# Altium schematic sheet ButtonStick.SchDoc: Button Stick
size Letter; ApprovedBy: Kevin Cotton; Author: Jessica Di Stefano; DrawnBy: J; Revision: A; SheetNumber: 3; SheetTotal: 7
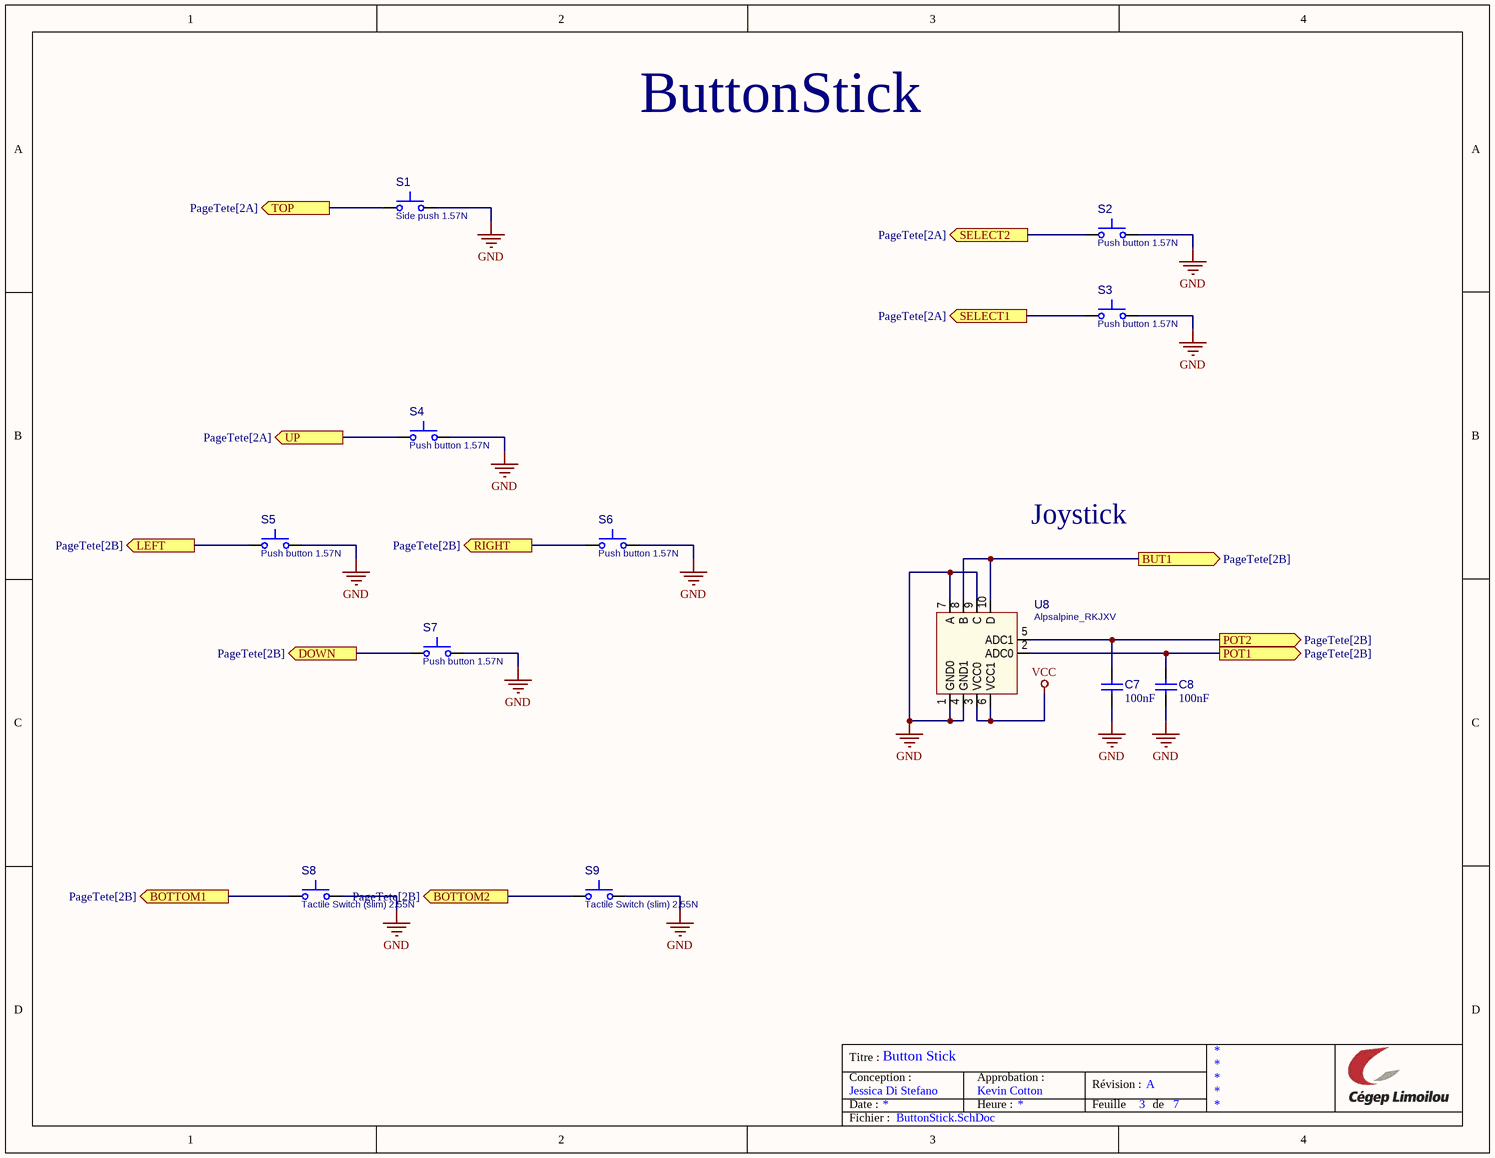
[diagram p0: ButtonStick.SchDoc]

## Parts
C7  value 100nF  [C_1005[0402]]  (hidden comment: Cap 100nF 0402)
C8  value 100nF  [C_1005[0402]]  (hidden comment: Cap 100nF 0402)
S1  value Side push 1.57N  [S_Alpsalpine_SKHHL]  (hidden comment: SKHHLNA010)
S2  value Push button 1.57N  [S_Alpsalpine_SKPM]  (hidden comment: SKPMAME010)
S3  value Push button 1.57N  [S_Alpsalpine_SKPM]  (hidden comment: SKPMAME010)
S4  value Push button 1.57N  [S_Alpsalpine_SKPM]  (hidden comment: SKPMAME010)
S5  value Push button 1.57N  [S_Alpsalpine_SKPM]  (hidden comment: SKPMAME010)
S6  value Push button 1.57N  [S_Alpsalpine_SKPM]  (hidden comment: SKPMAME010)
S7  value Push button 1.57N  [S_Alpsalpine_SKPM]  (hidden comment: SKPMAME010)
S8  value Tactile Switch (slim) 2.55N  [S_Alpsalpine_SKQG]  (hidden comment: SKQGADE010)
S9  value Tactile Switch (slim) 2.55N  [S_Alpsalpine_SKQG]  (hidden comment: SKQGADE010)
U8  value Alpsalpine_RKJXV  [U_Alpsalpine_RKJXV122400R]  (hidden comment: RKJXV122400R)

## Ports
BOTTOM1 (out, see PageTete[2B]), BOTTOM2 (out, see PageTete[2B]), BUT1 (out, see PageTete[2B]), DOWN (out, see PageTete[2B]), LEFT (out, see PageTete[2B]), POT1 (out, see PageTete[2B]), POT2 (out, see PageTete[2B]), RIGHT (out, see PageTete[2B]), SELECT1 (out, see PageTete[2A]), SELECT2 (out, see PageTete[2A]), TOP (out, see PageTete[2A]), UP (out, see PageTete[2A])

## Nets
GND: C7.1 C8.1 S1.2 S2.2 S3.2 S4.2 S5.2 S6.2 S7.2 S8.2 S9.2 U8.1(GND0) U8.4(GND1) U8.7(A) U8.9(C)
VCC: U8.3(VCC0) U8.6(VCC1)
BOTTOM1: S8.1 ; port BOTTOM1
BOTTOM2: S9.1 ; port BOTTOM2
BUT1: U8.8(B) U8.10(D) ; port BUT1
DOWN: S7.1 ; port DOWN
LEFT: S5.1 ; port LEFT
POT1: C8.2 U8.2(ADC0) ; port POT1
POT2: C7.2 U8.5(ADC1) ; port POT2
RIGHT: S6.1 ; port RIGHT
SELECT1: S3.1 ; port SELECT1
SELECT2: S2.1 ; port SELECT2
TOP: S1.1 ; port TOP
UP: S4.1 ; port UP

## Notes on the sheet
- ButtonStick
- Joystick
- Titre :
- Conception :
- Date :
- Approbation :
- Heure :
- Révision :
- Feuille
- de
- Fichier :

## Library data of the parts
C7 C8 = CAP001: Capacitor type 1; Manufacturer 1: Taiyo Yuden; Manufacturer Part Number 1: UMK105B7104KV-FR; CEGEP: KCOND01SM; Tolerance: 10%; Rated Voltage: 50V; Dielectric: X7R; LibRef: CAP001; Mount: SMT; Supplier 1: LCSC; Supplier Part Number 1: C2167491
S1 = SW_Push_SKHHL_157N: Side push 6.0mm Square Type (Snap-in) 1.57N l=3.85mm; Manufacturer 1: ALPSALPINE; Manufacturer Part Number 1: SKHHLNA010; Mounting Technology: TH; Supplier 1: LCSC; Supplier 2: DigiKey; Supplier Part Number 1: C125031; Supplier Part Number 2: 4809-SKHHLNA010-ND
S2-S7 = SW_Push_SKPM_157N: Push button 1.57N; Manufacturer 1: ALPSALPINE; Manufacturer Part Number 1: SKPMAME010; Mounting Technology: SMT; Supplier 1: LCSC; Supplier 2: DigiKey; Supplier Part Number 1: C115348; Supplier Part Number 2: 4809-SKPMAME010CT-ND
S8 S9 = SW_Push_SKQG_255N: Tactile Switch (dome) 2.55N; Manufacturer 1: ALPSALPINE; Manufacturer Part Number 1: SKQGADE010; Mounting Technology: SMT; Supplier 1: LCSC; Supplier 2: Digikey; Supplier Part Number 1: C116647; Supplier Part Number 2: 4809-SKQGADE010CT-ND
U8 = U_Alpsalpine_RKJXV: ThumbStick; Manufacturer 1: ALPSALPINE; Manufacturer Part Number 1: RKJXV122400R; Mounting Technology: TH; Supplier 1: LCSC; Supplier 2: Mouser; Supplier Part Number 1: C918854; Supplier Part Number 2: 688-RKJXV122400R